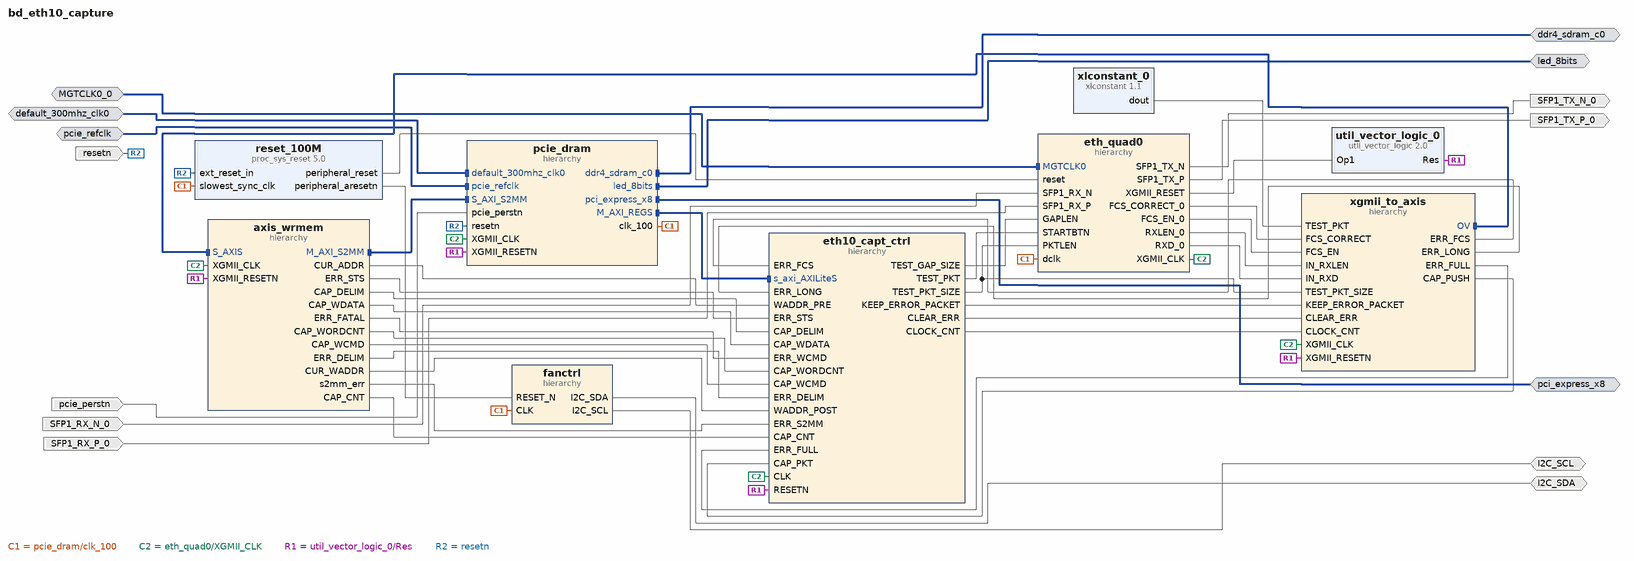
[diagram p0: block diagram of the top level]
# Vivado block design bd_eth10_capture, xcku115-flvb2104-2-e, Vivado 2018.2
create_bd_design bd_eth10_capture

create_bd_intf_port -mode Slave -vlnv xilinx.com:interface:diff_clock_rtl:1.0 MGTCLK0_0
set_property -dict {CONFIG.FREQ_HZ 156250000} [get_bd_intf_ports MGTCLK0_0]
create_bd_intf_port -mode Master -vlnv xilinx.com:interface:ddr4_rtl:1.0 ddr4_sdram_c0
create_bd_intf_port -mode Slave -vlnv xilinx.com:interface:diff_clock_rtl:1.0 default_300mhz_clk0
set_property -dict {CONFIG.FREQ_HZ 300000000} [get_bd_intf_ports default_300mhz_clk0]
create_bd_intf_port -mode Master -vlnv xilinx.com:interface:gpio_rtl:1.0 led_8bits
create_bd_intf_port -mode Master -vlnv xilinx.com:interface:pcie_7x_mgt_rtl:1.0 pci_express_x8
create_bd_intf_port -mode Slave -vlnv xilinx.com:interface:diff_clock_rtl:1.0 pcie_refclk
set_property -dict {CONFIG.FREQ_HZ 100000000} [get_bd_intf_ports pcie_refclk]
create_bd_port -dir IO I2C_SDA
create_bd_port -dir IO I2C_SCL
create_bd_port -dir I SFP1_RX_N_0
create_bd_port -dir I SFP1_RX_P_0
create_bd_port -dir O SFP1_TX_N_0
create_bd_port -dir O SFP1_TX_P_0
create_bd_port -dir I -type rst pcie_perstn
set_property -dict {CONFIG.POLARITY ACTIVE_LOW} [get_bd_ports pcie_perstn]
create_bd_port -dir I -type rst resetn
set_property -dict {CONFIG.POLARITY ACTIVE_LOW} [get_bd_ports resetn]

create_bd_cell -type hier eth_quad0
create_bd_cell -type hier fanctrl
create_bd_cell -type hier pcie_dram
create_bd_cell -type ip -vlnv xilinx.com:ip:proc_sys_reset:5.0 reset_100M
set_property -dict {CONFIG.USE_BOARD_FLOW true CONFIG.RESET_BOARD_INTERFACE resetn} [get_bd_cells reset_100M]
create_bd_cell -type ip -vlnv xilinx.com:ip:util_vector_logic:2.0 util_vector_logic_0
set_property -dict {CONFIG.C_SIZE 1 CONFIG.C_OPERATION not} [get_bd_cells util_vector_logic_0]
create_bd_cell -type hier eth10_capt_ctrl
create_bd_cell -type ip -vlnv xilinx.com:ip:xlconstant:1.1 xlconstant_0
set_property -dict {CONFIG.CONST_VAL 0} [get_bd_cells xlconstant_0]
create_bd_cell -type hier axis_wrmem
create_bd_cell -type hier xgmii_to_axis

# ---- hierarchy /eth_quad0 ----
current_bd_instance /eth_quad0
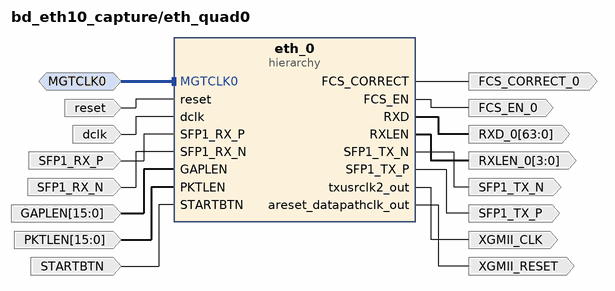
[diagram p1: block diagram inside /eth_quad0]
create_bd_intf_pin -mode Slave -vlnv xilinx.com:interface:diff_clock_rtl:1.0 MGTCLK0
create_bd_pin -dir I -type rst reset
create_bd_pin -dir I -type clk dclk
create_bd_pin -dir I SFP1_RX_P
create_bd_pin -dir O SFP1_TX_N
create_bd_pin -dir O SFP1_TX_P
create_bd_pin -dir I SFP1_RX_N
create_bd_pin -dir O -from 63 -to 0 RXD_0
create_bd_pin -dir O -from 3 -to 0 RXLEN_0
create_bd_pin -dir O FCS_CORRECT_0
create_bd_pin -dir O -type rst XGMII_RESET
create_bd_pin -dir O -type clk XGMII_CLK
create_bd_pin -dir O FCS_EN_0
create_bd_pin -dir I -from 15 -to 0 GAPLEN
create_bd_pin -dir I -from 15 -to 0 PKTLEN
create_bd_pin -dir I STARTBTN

create_bd_cell -type hier eth_0

# ---- hierarchy /eth_quad0/eth_0 ----
current_bd_instance /eth_quad0/eth_0
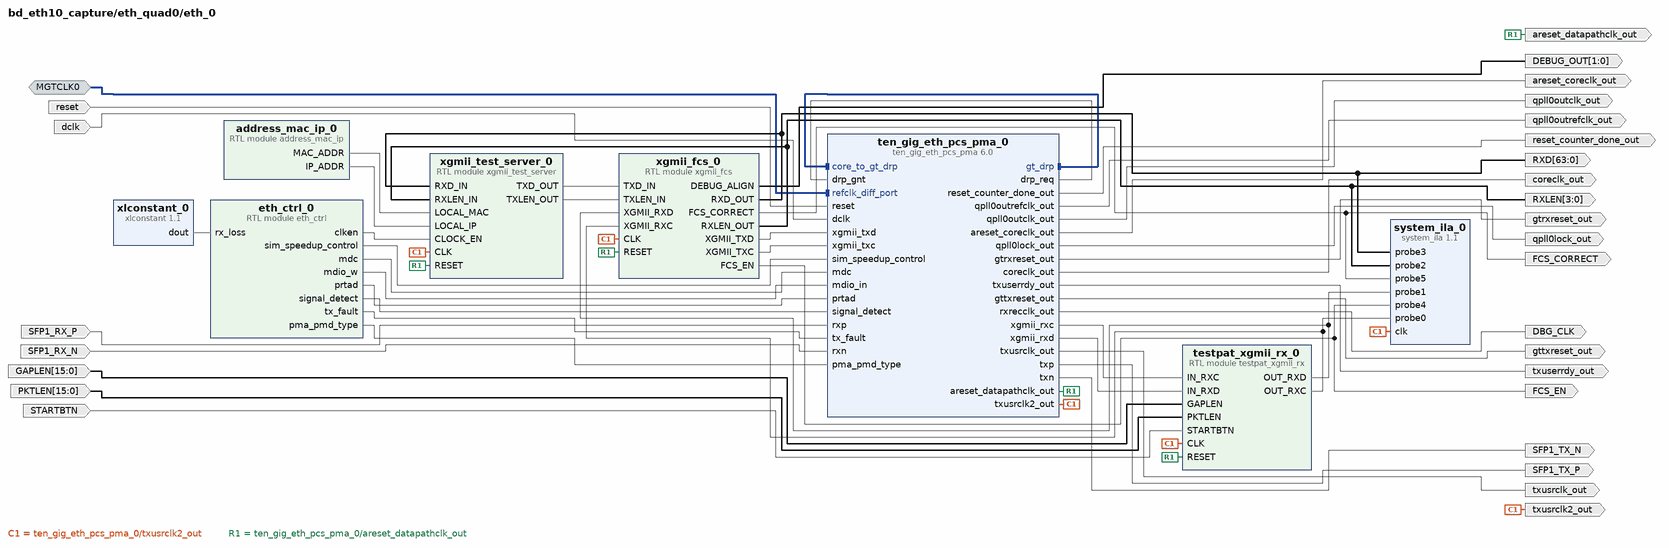
[diagram p2: block diagram inside /eth_quad0/eth_0]
create_bd_intf_pin -mode Slave -vlnv xilinx.com:interface:diff_clock_rtl:1.0 MGTCLK0
create_bd_pin -dir O -from 1 -to 0 DEBUG_OUT
create_bd_pin -dir I -type rst reset
create_bd_pin -dir I -type clk dclk
create_bd_pin -dir O reset_counter_done_out
create_bd_pin -dir O -type clk qpll0outrefclk_out
create_bd_pin -dir O -type clk qpll0outclk_out
create_bd_pin -dir O qpll0lock_out
create_bd_pin -dir O txuserrdy_out
create_bd_pin -dir O -type rst gtrxreset_out
create_bd_pin -dir O -type rst gttxreset_out
create_bd_pin -dir O -type rst areset_coreclk_out
create_bd_pin -dir O -type clk txusrclk_out
create_bd_pin -dir O -type clk coreclk_out
create_bd_pin -dir O -type clk txusrclk2_out
create_bd_pin -dir O SFP1_TX_P
create_bd_pin -dir O SFP1_TX_N
create_bd_pin -dir O -type clk DBG_CLK
create_bd_pin -dir I SFP1_RX_P
create_bd_pin -dir I SFP1_RX_N
create_bd_pin -dir O -type rst areset_datapathclk_out
create_bd_pin -dir O -from 63 -to 0 RXD
create_bd_pin -dir O -from 3 -to 0 RXLEN
create_bd_pin -dir O FCS_CORRECT
create_bd_pin -dir O FCS_EN
create_bd_pin -dir I -from 15 -to 0 GAPLEN
create_bd_pin -dir I -from 15 -to 0 PKTLEN
create_bd_pin -dir I STARTBTN

create_bd_cell -type ip -vlnv xilinx.com:ip:ten_gig_eth_pcs_pma:6.0 ten_gig_eth_pcs_pma_0
set_property -dict [list \
  CONFIG.base_kr BASE-R \
  CONFIG.no_ebuff false \
  CONFIG.SupportLevel 1 \
  CONFIG.Locations X0Y12 \
  CONFIG.RefClk clk0 \
] [get_bd_cells ten_gig_eth_pcs_pma_0]
create_bd_cell -type ip -vlnv xilinx.com:ip:xlconstant:1.1 xlconstant_0
set_property -dict {CONFIG.CONST_VAL 0} [get_bd_cells xlconstant_0]
create_bd_cell -type ip -vlnv xilinx.com:ip:system_ila:1.1 system_ila_0
set_property -dict {CONFIG.C_NUM_OF_PROBES 6 CONFIG.C_MON_TYPE NATIVE} [get_bd_cells system_ila_0]
create_bd_cell -type module -reference xgmii_test_server xgmii_test_server_0
create_bd_cell -type module -reference address_mac_ip address_mac_ip_0
create_bd_cell -type module -reference eth_ctrl eth_ctrl_0
create_bd_cell -type module -reference xgmii_fcs xgmii_fcs_0
create_bd_cell -type module -reference testpat_xgmii_rx testpat_xgmii_rx_0

# ---- hierarchy /fanctrl ----
current_bd_instance /fanctrl
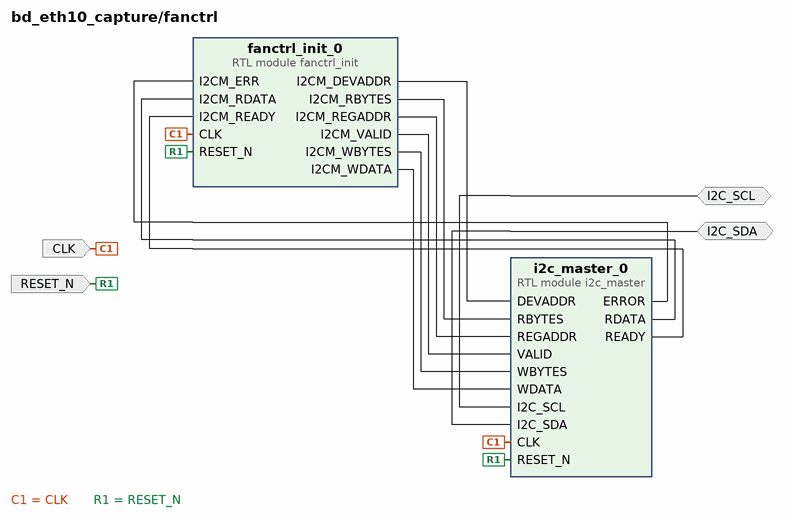
[diagram p3: block diagram inside /fanctrl]
create_bd_pin -dir I -type clk CLK
create_bd_pin -dir IO I2C_SCL
create_bd_pin -dir IO I2C_SDA
create_bd_pin -dir I -type rst RESET_N

create_bd_cell -type module -reference fanctrl_init fanctrl_init_0
create_bd_cell -type module -reference i2c_master i2c_master_0
set_property -dict {CONFIG.CLOCK_DIV 250} [get_bd_cells i2c_master_0]

# ---- hierarchy /pcie_dram ----
current_bd_instance /pcie_dram
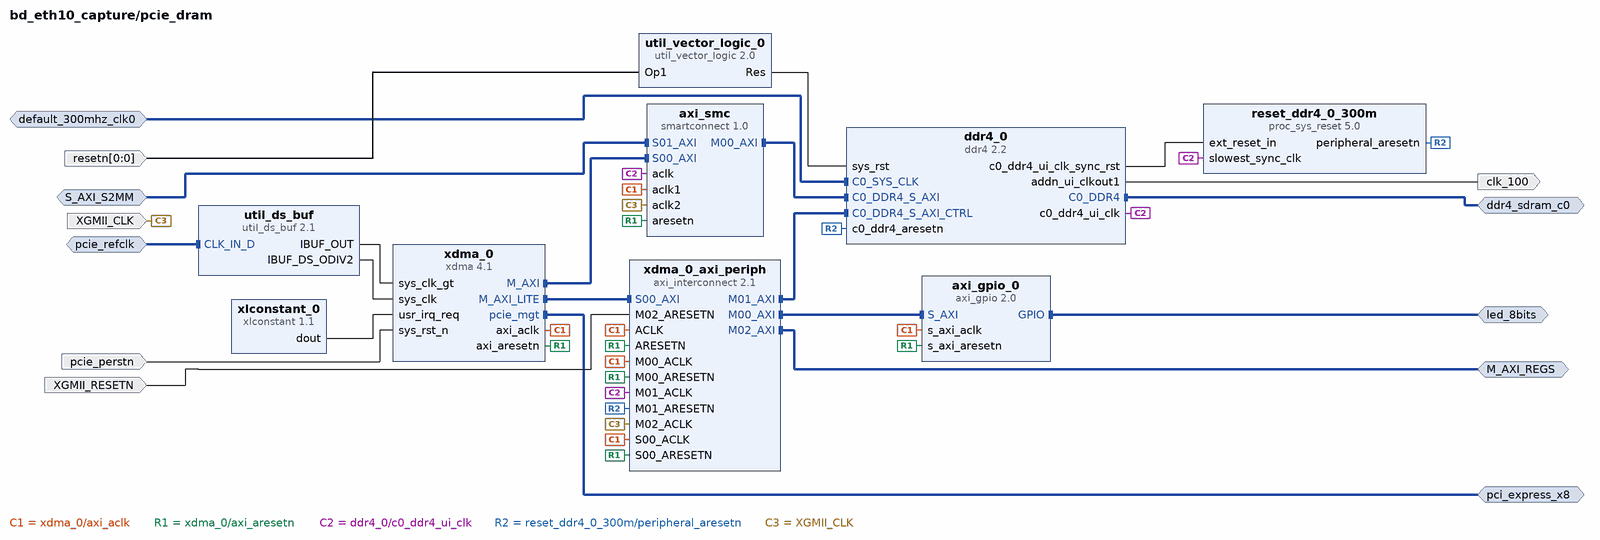
[diagram p4: block diagram inside /pcie_dram]
create_bd_intf_pin -mode Master -vlnv xilinx.com:interface:pcie_7x_mgt_rtl:1.0 pci_express_x8
create_bd_intf_pin -mode Slave -vlnv xilinx.com:interface:diff_clock_rtl:1.0 pcie_refclk
create_bd_intf_pin -mode Master -vlnv xilinx.com:interface:gpio_rtl:1.0 led_8bits
create_bd_intf_pin -mode Slave -vlnv xilinx.com:interface:diff_clock_rtl:1.0 default_300mhz_clk0
create_bd_intf_pin -mode Master -vlnv xilinx.com:interface:ddr4_rtl:1.0 ddr4_sdram_c0
create_bd_intf_pin -mode Slave -vlnv xilinx.com:interface:aximm_rtl:1.0 S_AXI_S2MM
create_bd_intf_pin -mode Master -vlnv xilinx.com:interface:aximm_rtl:1.0 M_AXI_REGS
create_bd_pin -dir I -type rst pcie_perstn
create_bd_pin -dir O -type clk clk_100
create_bd_pin -dir I -type clk XGMII_CLK
create_bd_pin -dir I -from 0 -to 0 resetn
create_bd_pin -dir I -type rst XGMII_RESETN

create_bd_cell -type ip -vlnv xilinx.com:ip:xdma:4.1 xdma_0
set_property -dict [list \
  CONFIG.mode_selection Advanced \
  CONFIG.pl_link_cap_max_link_speed 8.0_GT/s \
  CONFIG.axi_data_width 256_bit \
  CONFIG.axisten_freq 250 \
  CONFIG.en_ext_ch_gt_drp FALSE \
  CONFIG.dedicate_perst true \
  CONFIG.mcap_enablement None \
  CONFIG.pf0_device_id 8038 \
  CONFIG.pf0_revision_id a5 \
  CONFIG.axilite_master_en true \
  CONFIG.axilite_master_size 512 \
  CONFIG.axilite_master_scale Kilobytes \
  CONFIG.xdma_rnum_chnl 1 \
  CONFIG.xdma_wnum_chnl 1 \
  CONFIG.SYS_RST_N_BOARD_INTERFACE pcie_perstn \
  CONFIG.PCIE_BOARD_INTERFACE pci_express_x8 \
  CONFIG.plltype QPLL1 \
  CONFIG.xdma_axi_intf_mm AXI_Memory_Mapped \
  CONFIG.xdma_pcie_64bit_en true \
  CONFIG.xdma_sts_ports false \
  CONFIG.cfg_mgmt_if false \
  CONFIG.xdma_pcie_prefetchable true \
  CONFIG.pf1_bar0_size 128 \
  CONFIG.pf1_bar0_scale Kilobytes \
  CONFIG.pf1_bar1_enabled false \
  CONFIG.dma_reset_source_sel Phy_Ready \
  CONFIG.pcie_id_if false \
  CONFIG.PF0_DEVICE_ID_mqdma 9038 \
  CONFIG.PF2_DEVICE_ID_mqdma 9038 \
  CONFIG.PF3_DEVICE_ID_mqdma 9038 \
] [get_bd_cells xdma_0]
create_bd_cell -type ip -vlnv xilinx.com:ip:util_ds_buf:2.1 util_ds_buf
set_property -dict {CONFIG.USE_BOARD_FLOW true CONFIG.DIFF_CLK_IN_BOARD_INTERFACE pcie_refclk} [get_bd_cells util_ds_buf]
create_bd_cell -type ip -vlnv xilinx.com:ip:xlconstant:1.1 xlconstant_0
set_property -dict {CONFIG.CONST_VAL 0} [get_bd_cells xlconstant_0]
create_bd_cell -type ip -vlnv xilinx.com:ip:axi_gpio:2.0 axi_gpio_0
set_property -dict {CONFIG.USE_BOARD_FLOW true CONFIG.GPIO_BOARD_INTERFACE led_8bits} [get_bd_cells axi_gpio_0]
create_bd_cell -type ip -vlnv xilinx.com:ip:ddr4:2.2 ddr4_0
set_property -dict [list \
  CONFIG.C0_CLOCK_BOARD_INTERFACE default_300mhz_clk0 \
  CONFIG.C0_DDR4_BOARD_INTERFACE ddr4_sdram_c0 \
] [get_bd_cells ddr4_0]
create_bd_cell -type ip -vlnv xilinx.com:ip:util_vector_logic:2.0 util_vector_logic_0
set_property -dict {CONFIG.C_SIZE 1 CONFIG.C_OPERATION not} [get_bd_cells util_vector_logic_0]
create_bd_cell -type ip -vlnv xilinx.com:ip:proc_sys_reset:5.0 reset_ddr4_0_300m
create_bd_cell -type ip -vlnv xilinx.com:ip:axi_interconnect:2.1 xdma_0_axi_periph
set_property -dict {CONFIG.NUM_MI 3} [get_bd_cells xdma_0_axi_periph]
create_bd_cell -type ip -vlnv xilinx.com:ip:smartconnect:1.0 axi_smc
set_property -dict {CONFIG.NUM_SI 2 CONFIG.NUM_CLKS 3} [get_bd_cells axi_smc]

# ---- hierarchy /eth10_capt_ctrl ----
current_bd_instance /eth10_capt_ctrl
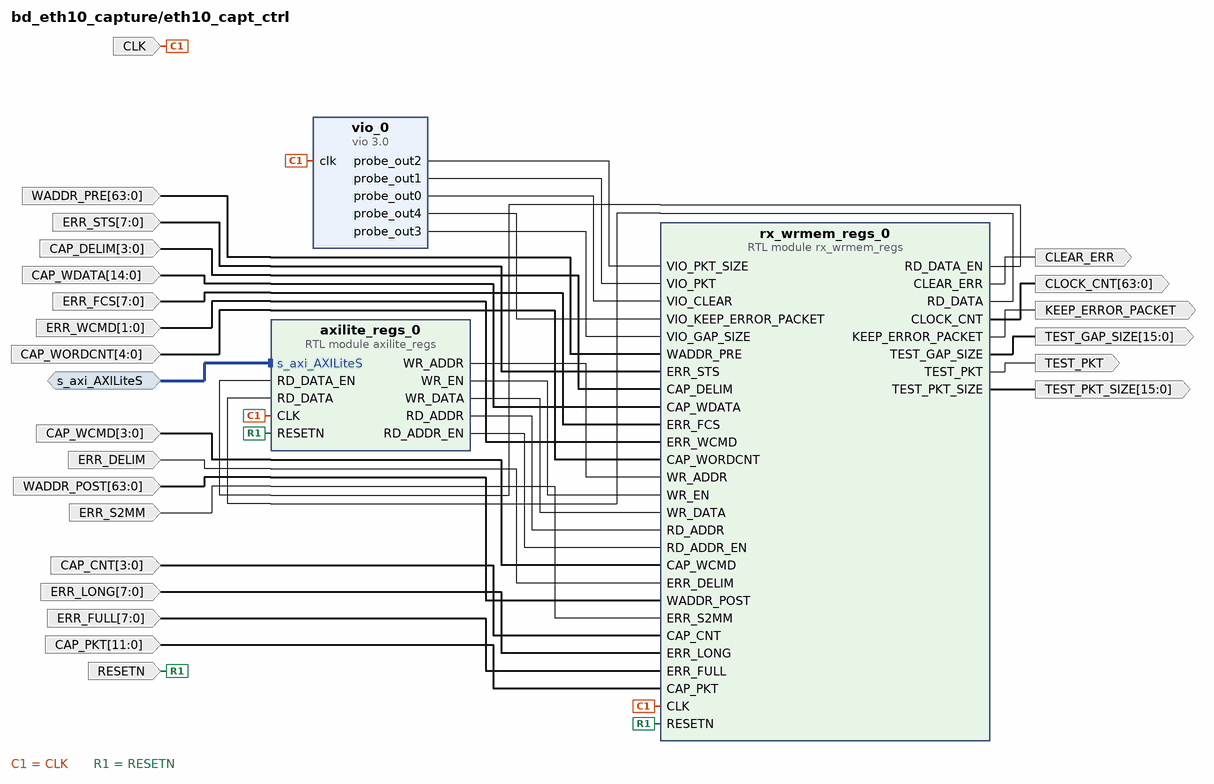
[diagram p5: block diagram inside /eth10_capt_ctrl]
create_bd_intf_pin -mode Slave -vlnv xilinx.com:interface:aximm_rtl:1.0 s_axi_AXILiteS
create_bd_pin -dir I -type clk CLK
create_bd_pin -dir I -type rst RESETN
create_bd_pin -dir I -from 63 -to 0 WADDR_PRE
create_bd_pin -dir I -from 7 -to 0 ERR_STS
create_bd_pin -dir O KEEP_ERROR_PACKET
create_bd_pin -dir I -from 3 -to 0 CAP_DELIM
create_bd_pin -dir I -from 14 -to 0 CAP_WDATA
create_bd_pin -dir I -from 7 -to 0 ERR_FCS
create_bd_pin -dir I -from 1 -to 0 ERR_WCMD
create_bd_pin -dir I -from 4 -to 0 CAP_WORDCNT
create_bd_pin -dir I -from 3 -to 0 CAP_WCMD
create_bd_pin -dir I ERR_DELIM
create_bd_pin -dir O -from 15 -to 0 TEST_GAP_SIZE
create_bd_pin -dir O -from 15 -to 0 TEST_PKT_SIZE
create_bd_pin -dir O TEST_PKT
create_bd_pin -dir I -from 63 -to 0 WADDR_POST
create_bd_pin -dir O CLEAR_ERR
create_bd_pin -dir I ERR_S2MM
create_bd_pin -dir I -from 3 -to 0 CAP_CNT
create_bd_pin -dir I -from 7 -to 0 ERR_LONG
create_bd_pin -dir I -from 7 -to 0 ERR_FULL
create_bd_pin -dir I -from 11 -to 0 CAP_PKT
create_bd_pin -dir O -from 63 -to 0 CLOCK_CNT

create_bd_cell -type ip -vlnv xilinx.com:ip:vio:3.0 vio_0
set_property -dict [list \
  CONFIG.C_PROBE_OUT3_INIT_VAL 0x000c \
  CONFIG.C_PROBE_OUT2_INIT_VAL 0x0040 \
  CONFIG.C_PROBE_OUT1_INIT_VAL 0x0 \
  CONFIG.C_PROBE_OUT3_WIDTH 16 \
  CONFIG.C_PROBE_OUT2_WIDTH 16 \
  CONFIG.C_PROBE_OUT1_WIDTH 1 \
  CONFIG.C_NUM_PROBE_OUT 5 \
  CONFIG.C_NUM_PROBE_IN 0 \
] [get_bd_cells vio_0]
create_bd_cell -type module -reference axilite_regs axilite_regs_0
create_bd_cell -type module -reference rx_wrmem_regs rx_wrmem_regs_0

# ---- hierarchy /axis_wrmem ----
current_bd_instance /axis_wrmem
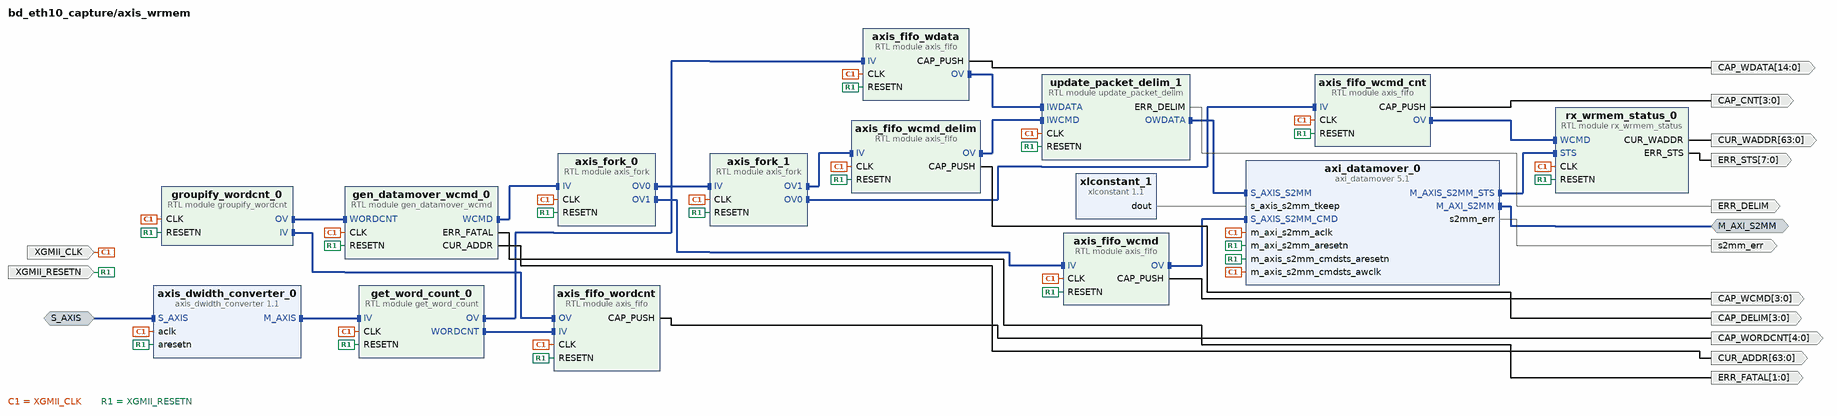
[diagram p6: block diagram inside /axis_wrmem]
create_bd_intf_pin -mode Master -vlnv xilinx.com:interface:aximm_rtl:1.0 M_AXI_S2MM
create_bd_intf_pin -mode Slave -vlnv xilinx.com:interface:axis_rtl:1.0 S_AXIS
create_bd_pin -dir O ERR_DELIM
create_bd_pin -dir O s2mm_err
create_bd_pin -dir O -from 1 -to 0 ERR_FATAL
create_bd_pin -dir I -type clk XGMII_CLK
create_bd_pin -dir I -type rst XGMII_RESETN
create_bd_pin -dir O -from 3 -to 0 CAP_WCMD
create_bd_pin -dir O -from 4 -to 0 CAP_WORDCNT
create_bd_pin -dir O -from 14 -to 0 CAP_WDATA
create_bd_pin -dir O -from 3 -to 0 CAP_DELIM
create_bd_pin -dir O -from 3 -to 0 CAP_CNT
create_bd_pin -dir O -from 63 -to 0 CUR_ADDR
create_bd_pin -dir O -from 7 -to 0 ERR_STS
create_bd_pin -dir O -from 63 -to 0 CUR_WADDR

create_bd_cell -type ip -vlnv xilinx.com:ip:axi_datamover:5.1 axi_datamover_0
set_property -dict [list \
  CONFIG.c_m_axi_s2mm_data_width 128 \
  CONFIG.c_s_axis_s2mm_tdata_width 128 \
  CONFIG.c_s2mm_burst_size 256 \
  CONFIG.c_s2mm_btt_used 23 \
  CONFIG.c_enable_mm2s 0 \
  CONFIG.c_addr_width 64 \
  CONFIG.c_dummy 1 \
] [get_bd_cells axi_datamover_0]
create_bd_cell -type ip -vlnv xilinx.com:ip:xlconstant:1.1 xlconstant_1
set_property -dict {CONFIG.CONST_WIDTH 16 CONFIG.CONST_VAL 65535} [get_bd_cells xlconstant_1]
create_bd_cell -type ip -vlnv xilinx.com:ip:axis_dwidth_converter:1.1 axis_dwidth_converter_0
set_property -dict [list \
  CONFIG.S_TDATA_NUM_BYTES 8 \
  CONFIG.M_TDATA_NUM_BYTES 16 \
  CONFIG.TID_WIDTH 0 \
  CONFIG.TDEST_WIDTH 0 \
  CONFIG.TUSER_BITS_PER_BYTE 0 \
  CONFIG.HAS_TLAST 1 \
  CONFIG.HAS_TSTRB 0 \
  CONFIG.HAS_TKEEP 0 \
  CONFIG.HAS_MI_TKEEP 1 \
] [get_bd_cells axis_dwidth_converter_0]
create_bd_cell -type module -reference update_packet_delim update_packet_delim_1
create_bd_cell -type module -reference groupify_wordcnt groupify_wordcnt_0
create_bd_cell -type module -reference get_word_count get_word_count_0
set_property -dict {CONFIG.WORD_SIZE_L2 4} [get_bd_cells get_word_count_0]
create_bd_cell -type module -reference gen_datamover_wcmd gen_datamover_wcmd_0
create_bd_cell -type module -reference rx_wrmem_status rx_wrmem_status_0
create_bd_cell -type module -reference axis_fifo axis_fifo_wcmd
set_property -dict {CONFIG.WIDTH_DATA 104 CONFIG.FIFO_SIZE_L2 0 CONFIG.FIFO_REG 8} [get_bd_cells axis_fifo_wcmd]
create_bd_cell -type module -reference axis_fifo axis_fifo_wcmd_cnt
set_property -dict {CONFIG.WIDTH_DATA 104 CONFIG.FIFO_SIZE_L2 0 CONFIG.FIFO_REG 8} [get_bd_cells axis_fifo_wcmd_cnt]
create_bd_cell -type module -reference axis_fifo axis_fifo_wcmd_delim
set_property -dict {CONFIG.WIDTH_DATA 104 CONFIG.FIFO_SIZE_L2 0 CONFIG.FIFO_REG 8} [get_bd_cells axis_fifo_wcmd_delim]
create_bd_cell -type module -reference axis_fifo axis_fifo_wdata
set_property -dict {CONFIG.WIDTH_DATA 128 CONFIG.FIFO_SIZE_L2 14} [get_bd_cells axis_fifo_wdata]
create_bd_cell -type module -reference axis_fifo axis_fifo_wordcnt
set_property -dict [list \
  CONFIG.WIDTH_DATA 16 \
  CONFIG.WIDTH_LAST 0 \
  CONFIG.FIFO_SIZE_L2 0 \
  CONFIG.FIFO_REG 16 \
] [get_bd_cells axis_fifo_wordcnt]
create_bd_cell -type module -reference axis_fork axis_fork_0
set_property -dict {CONFIG.WIDTH_DATA 104 CONFIG.WIDTH_LAST 0} [get_bd_cells axis_fork_0]
create_bd_cell -type module -reference axis_fork axis_fork_1
set_property -dict {CONFIG.WIDTH_DATA 104 CONFIG.WIDTH_LAST 0} [get_bd_cells axis_fork_1]

# ---- hierarchy /xgmii_to_axis ----
current_bd_instance /xgmii_to_axis
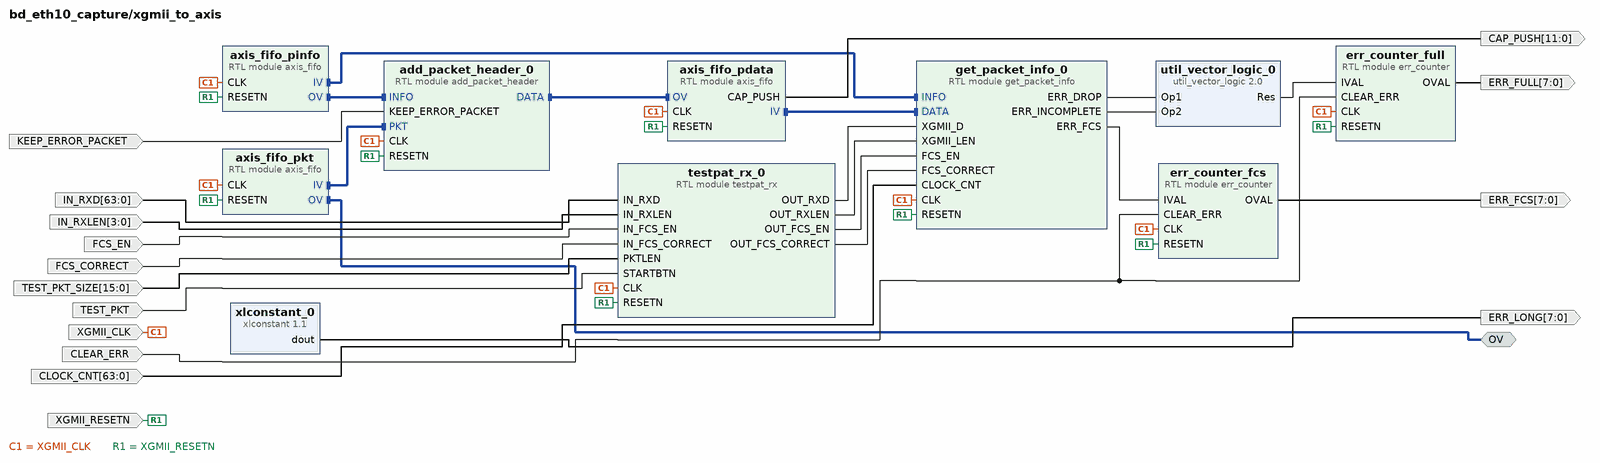
[diagram p7: block diagram inside /xgmii_to_axis]
create_bd_intf_pin -mode Master -vlnv xilinx.com:interface:axis_rtl:1.0 OV
create_bd_pin -dir I -type clk XGMII_CLK
create_bd_pin -dir I -from 63 -to 0 IN_RXD
create_bd_pin -dir I -from 3 -to 0 IN_RXLEN
create_bd_pin -dir I -type rst XGMII_RESETN
create_bd_pin -dir I FCS_EN
create_bd_pin -dir I FCS_CORRECT
create_bd_pin -dir O -from 7 -to 0 ERR_FCS
create_bd_pin -dir I -from 15 -to 0 TEST_PKT_SIZE
create_bd_pin -dir I TEST_PKT
create_bd_pin -dir I CLEAR_ERR
create_bd_pin -dir O -from 7 -to 0 ERR_LONG
create_bd_pin -dir O -from 7 -to 0 ERR_FULL
create_bd_pin -dir O -from 11 -to 0 CAP_PUSH
create_bd_pin -dir I KEEP_ERROR_PACKET
create_bd_pin -dir I -from 63 -to 0 CLOCK_CNT

create_bd_cell -type ip -vlnv xilinx.com:ip:xlconstant:1.1 xlconstant_0
set_property -dict {CONFIG.CONST_WIDTH 8 CONFIG.CONST_VAL 0} [get_bd_cells xlconstant_0]
create_bd_cell -type ip -vlnv xilinx.com:ip:util_vector_logic:2.0 util_vector_logic_0
set_property -dict {CONFIG.C_SIZE 1 CONFIG.C_OPERATION or} [get_bd_cells util_vector_logic_0]
create_bd_cell -type module -reference axis_fifo axis_fifo_pdata
set_property -dict {CONFIG.WIDTH_LAST 0 CONFIG.FIFO_SIZE_L2 11} [get_bd_cells axis_fifo_pdata]
create_bd_cell -type module -reference axis_fifo axis_fifo_pinfo
set_property -dict {CONFIG.WIDTH_DATA 64 CONFIG.WIDTH_LAST 0 CONFIG.FIFO_SIZE_L2 10} [get_bd_cells axis_fifo_pinfo]
create_bd_cell -type module -reference axis_fifo axis_fifo_pkt
set_property -dict {CONFIG.FIFO_SIZE_L2 0} [get_bd_cells axis_fifo_pkt]
create_bd_cell -type module -reference err_counter err_counter_fcs
create_bd_cell -type module -reference err_counter err_counter_full
create_bd_cell -type module -reference testpat_rx testpat_rx_0
create_bd_cell -type module -reference add_packet_header add_packet_header_0
create_bd_cell -type module -reference get_packet_info get_packet_info_0

# ---- connections ----

current_bd_instance /eth_quad0
connect_bd_intf_net [get_bd_intf_pins MGTCLK0] [get_bd_intf_pins eth_0/MGTCLK0]
connect_bd_net [get_bd_pins reset] [get_bd_pins eth_0/reset]
connect_bd_net [get_bd_pins dclk] [get_bd_pins eth_0/dclk]
connect_bd_net [get_bd_pins SFP1_RX_P] [get_bd_pins eth_0/SFP1_RX_P]
connect_bd_net [get_bd_pins eth_0/SFP1_TX_N] [get_bd_pins SFP1_TX_N]
connect_bd_net [get_bd_pins eth_0/SFP1_TX_P] [get_bd_pins SFP1_TX_P]
connect_bd_net [get_bd_pins SFP1_RX_N] [get_bd_pins eth_0/SFP1_RX_N]
connect_bd_net [get_bd_pins eth_0/RXD] [get_bd_pins RXD_0]
connect_bd_net [get_bd_pins eth_0/RXLEN] [get_bd_pins RXLEN_0]
connect_bd_net [get_bd_pins eth_0/FCS_CORRECT] [get_bd_pins FCS_CORRECT_0]
connect_bd_net [get_bd_pins eth_0/areset_datapathclk_out] [get_bd_pins XGMII_RESET]
connect_bd_net [get_bd_pins eth_0/txusrclk2_out] [get_bd_pins XGMII_CLK]
connect_bd_net [get_bd_pins eth_0/FCS_EN] [get_bd_pins FCS_EN_0]
connect_bd_net -net GAPLEN_0_1 [get_bd_pins GAPLEN] [get_bd_pins eth_0/GAPLEN]
connect_bd_net -net PKTLEN_0_1 [get_bd_pins PKTLEN] [get_bd_pins eth_0/PKTLEN]
connect_bd_net -net STARTBTN_0_1 [get_bd_pins STARTBTN] [get_bd_pins eth_0/STARTBTN]

current_bd_instance /eth_quad0/eth_0
connect_bd_intf_net [get_bd_intf_pins ten_gig_eth_pcs_pma_0/core_to_gt_drp] [get_bd_intf_pins ten_gig_eth_pcs_pma_0/gt_drp]
connect_bd_intf_net [get_bd_intf_pins MGTCLK0] [get_bd_intf_pins ten_gig_eth_pcs_pma_0/refclk_diff_port]
connect_bd_net -net CLK_1 [get_bd_pins ten_gig_eth_pcs_pma_0/txusrclk2_out] \
  [get_bd_pins txusrclk2_out] [get_bd_pins system_ila_0/clk] [get_bd_pins xgmii_test_server_0/CLK] \
  [get_bd_pins xgmii_fcs_0/CLK] [get_bd_pins testpat_xgmii_rx_0/CLK]
connect_bd_net [get_bd_pins xgmii_fcs_0/RXD_OUT] [get_bd_pins RXD] [get_bd_pins system_ila_0/probe3] [get_bd_pins xgmii_test_server_0/RXD_IN]
connect_bd_net [get_bd_pins xgmii_fcs_0/RXLEN_OUT] [get_bd_pins RXLEN] [get_bd_pins system_ila_0/probe2] [get_bd_pins xgmii_test_server_0/RXLEN_IN]
connect_bd_net [get_bd_pins xgmii_test_server_0/TXD_OUT] [get_bd_pins xgmii_fcs_0/TXD_IN]
connect_bd_net [get_bd_pins xgmii_test_server_0/TXLEN_OUT] [get_bd_pins xgmii_fcs_0/TXLEN_IN]
connect_bd_net [get_bd_pins xgmii_fcs_0/DEBUG_ALIGN] [get_bd_pins DEBUG_OUT]
connect_bd_net [get_bd_pins address_mac_ip_0/MAC_ADDR] [get_bd_pins xgmii_test_server_0/LOCAL_MAC]
connect_bd_net [get_bd_pins address_mac_ip_0/IP_ADDR] [get_bd_pins xgmii_test_server_0/LOCAL_IP]
connect_bd_net [get_bd_pins ten_gig_eth_pcs_pma_0/drp_req] [get_bd_pins ten_gig_eth_pcs_pma_0/drp_gnt]
connect_bd_net [get_bd_pins xgmii_fcs_0/XGMII_TXD] [get_bd_pins ten_gig_eth_pcs_pma_0/xgmii_txd]
connect_bd_net [get_bd_pins xgmii_fcs_0/XGMII_TXC] [get_bd_pins ten_gig_eth_pcs_pma_0/xgmii_txc]
connect_bd_net -net ten_gig_eth_pcs_pma_0_xgmii_rxd [get_bd_pins testpat_xgmii_rx_0/OUT_RXD] \
  [get_bd_pins system_ila_0/probe1] [get_bd_pins xgmii_fcs_0/XGMII_RXD]
connect_bd_net -net ten_gig_eth_pcs_pma_0_xgmii_rxc [get_bd_pins testpat_xgmii_rx_0/OUT_RXC] \
  [get_bd_pins system_ila_0/probe0] [get_bd_pins xgmii_fcs_0/XGMII_RXC]
connect_bd_net [get_bd_pins reset] [get_bd_pins ten_gig_eth_pcs_pma_0/reset]
connect_bd_net [get_bd_pins dclk] [get_bd_pins ten_gig_eth_pcs_pma_0/dclk]
connect_bd_net [get_bd_pins ten_gig_eth_pcs_pma_0/reset_counter_done_out] [get_bd_pins reset_counter_done_out]
connect_bd_net [get_bd_pins ten_gig_eth_pcs_pma_0/qpll0outrefclk_out] [get_bd_pins qpll0outrefclk_out]
connect_bd_net [get_bd_pins ten_gig_eth_pcs_pma_0/qpll0outclk_out] [get_bd_pins qpll0outclk_out]
connect_bd_net [get_bd_pins ten_gig_eth_pcs_pma_0/qpll0lock_out] [get_bd_pins qpll0lock_out]
connect_bd_net [get_bd_pins ten_gig_eth_pcs_pma_0/txuserrdy_out] [get_bd_pins txuserrdy_out]
connect_bd_net [get_bd_pins ten_gig_eth_pcs_pma_0/gtrxreset_out] [get_bd_pins gtrxreset_out]
connect_bd_net [get_bd_pins ten_gig_eth_pcs_pma_0/gttxreset_out] [get_bd_pins gttxreset_out]
connect_bd_net [get_bd_pins ten_gig_eth_pcs_pma_0/areset_coreclk_out] [get_bd_pins areset_coreclk_out]
connect_bd_net [get_bd_pins ten_gig_eth_pcs_pma_0/txusrclk_out] [get_bd_pins txusrclk_out]
connect_bd_net [get_bd_pins ten_gig_eth_pcs_pma_0/coreclk_out] [get_bd_pins coreclk_out]
connect_bd_net [get_bd_pins ten_gig_eth_pcs_pma_0/txp] [get_bd_pins SFP1_TX_P]
connect_bd_net [get_bd_pins ten_gig_eth_pcs_pma_0/txn] [get_bd_pins SFP1_TX_N]
connect_bd_net [get_bd_pins ten_gig_eth_pcs_pma_0/rxrecclk_out] [get_bd_pins DBG_CLK]
connect_bd_net [get_bd_pins SFP1_RX_P] [get_bd_pins ten_gig_eth_pcs_pma_0/rxp]
connect_bd_net [get_bd_pins SFP1_RX_N] [get_bd_pins ten_gig_eth_pcs_pma_0/rxn]
connect_bd_net [get_bd_pins eth_ctrl_0/clken] [get_bd_pins xgmii_test_server_0/CLOCK_EN]
connect_bd_net [get_bd_pins eth_ctrl_0/sim_speedup_control] [get_bd_pins ten_gig_eth_pcs_pma_0/sim_speedup_control]
connect_bd_net [get_bd_pins eth_ctrl_0/mdc] [get_bd_pins ten_gig_eth_pcs_pma_0/mdc]
connect_bd_net [get_bd_pins eth_ctrl_0/mdio_w] [get_bd_pins ten_gig_eth_pcs_pma_0/mdio_in]
connect_bd_net [get_bd_pins eth_ctrl_0/prtad] [get_bd_pins ten_gig_eth_pcs_pma_0/prtad]
connect_bd_net [get_bd_pins eth_ctrl_0/signal_detect] [get_bd_pins ten_gig_eth_pcs_pma_0/signal_detect]
connect_bd_net [get_bd_pins eth_ctrl_0/tx_fault] [get_bd_pins ten_gig_eth_pcs_pma_0/tx_fault]
connect_bd_net [get_bd_pins eth_ctrl_0/pma_pmd_type] [get_bd_pins ten_gig_eth_pcs_pma_0/pma_pmd_type]
connect_bd_net [get_bd_pins xlconstant_0/dout] [get_bd_pins eth_ctrl_0/rx_loss]
connect_bd_net [get_bd_pins ten_gig_eth_pcs_pma_0/areset_datapathclk_out] \
  [get_bd_pins areset_datapathclk_out] [get_bd_pins xgmii_test_server_0/RESET] [get_bd_pins xgmii_fcs_0/RESET] \
  [get_bd_pins testpat_xgmii_rx_0/RESET]
connect_bd_net [get_bd_pins xgmii_fcs_0/FCS_CORRECT] [get_bd_pins FCS_CORRECT] [get_bd_pins system_ila_0/probe5]
connect_bd_net [get_bd_pins xgmii_fcs_0/FCS_EN] [get_bd_pins FCS_EN] [get_bd_pins system_ila_0/probe4]
connect_bd_net [get_bd_pins ten_gig_eth_pcs_pma_0/xgmii_rxc] [get_bd_pins testpat_xgmii_rx_0/IN_RXC]
connect_bd_net [get_bd_pins ten_gig_eth_pcs_pma_0/xgmii_rxd] [get_bd_pins testpat_xgmii_rx_0/IN_RXD]
connect_bd_net -net GAPLEN_0_1 [get_bd_pins GAPLEN] [get_bd_pins testpat_xgmii_rx_0/GAPLEN]
connect_bd_net -net PKTLEN_0_1 [get_bd_pins PKTLEN] [get_bd_pins testpat_xgmii_rx_0/PKTLEN]
connect_bd_net -net STARTBTN_0_1 [get_bd_pins STARTBTN] [get_bd_pins testpat_xgmii_rx_0/STARTBTN]

current_bd_instance /fanctrl
connect_bd_net [get_bd_pins CLK] [get_bd_pins fanctrl_init_0/CLK] [get_bd_pins i2c_master_0/CLK]
connect_bd_net [get_bd_pins I2C_SDA] [get_bd_pins i2c_master_0/I2C_SDA]
connect_bd_net [get_bd_pins I2C_SCL] [get_bd_pins i2c_master_0/I2C_SCL]
connect_bd_net [get_bd_pins RESET_N] [get_bd_pins fanctrl_init_0/RESET_N] [get_bd_pins i2c_master_0/RESET_N]
connect_bd_net [get_bd_pins fanctrl_init_0/I2CM_DEVADDR] [get_bd_pins i2c_master_0/DEVADDR]
connect_bd_net [get_bd_pins fanctrl_init_0/I2CM_RBYTES] [get_bd_pins i2c_master_0/RBYTES]
connect_bd_net [get_bd_pins fanctrl_init_0/I2CM_REGADDR] [get_bd_pins i2c_master_0/REGADDR]
connect_bd_net [get_bd_pins fanctrl_init_0/I2CM_VALID] [get_bd_pins i2c_master_0/VALID]
connect_bd_net [get_bd_pins fanctrl_init_0/I2CM_WBYTES] [get_bd_pins i2c_master_0/WBYTES]
connect_bd_net [get_bd_pins fanctrl_init_0/I2CM_WDATA] [get_bd_pins i2c_master_0/WDATA]
connect_bd_net [get_bd_pins i2c_master_0/ERROR] [get_bd_pins fanctrl_init_0/I2CM_ERR]
connect_bd_net [get_bd_pins i2c_master_0/RDATA] [get_bd_pins fanctrl_init_0/I2CM_RDATA]
connect_bd_net [get_bd_pins i2c_master_0/READY] [get_bd_pins fanctrl_init_0/I2CM_READY]

current_bd_instance /pcie_dram
connect_bd_intf_net [get_bd_intf_pins xdma_0/M_AXI_LITE] [get_bd_intf_pins xdma_0_axi_periph/S00_AXI]
connect_bd_intf_net [get_bd_intf_pins xdma_0_axi_periph/M00_AXI] [get_bd_intf_pins axi_gpio_0/S_AXI]
connect_bd_intf_net [get_bd_intf_pins xdma_0_axi_periph/M01_AXI] [get_bd_intf_pins ddr4_0/C0_DDR4_S_AXI_CTRL]
connect_bd_intf_net [get_bd_intf_pins xdma_0/M_AXI] [get_bd_intf_pins axi_smc/S00_AXI]
connect_bd_intf_net [get_bd_intf_pins axi_smc/M00_AXI] [get_bd_intf_pins ddr4_0/C0_DDR4_S_AXI]
connect_bd_intf_net [get_bd_intf_pins pci_express_x8] [get_bd_intf_pins xdma_0/pcie_mgt]
connect_bd_intf_net [get_bd_intf_pins pcie_refclk] [get_bd_intf_pins util_ds_buf/CLK_IN_D]
connect_bd_intf_net [get_bd_intf_pins led_8bits] [get_bd_intf_pins axi_gpio_0/GPIO]
connect_bd_intf_net [get_bd_intf_pins default_300mhz_clk0] [get_bd_intf_pins ddr4_0/C0_SYS_CLK]
connect_bd_intf_net [get_bd_intf_pins ddr4_sdram_c0] [get_bd_intf_pins ddr4_0/C0_DDR4]
connect_bd_intf_net [get_bd_intf_pins S_AXI_S2MM] [get_bd_intf_pins axi_smc/S01_AXI]
connect_bd_intf_net [get_bd_intf_pins M_AXI_REGS] [get_bd_intf_pins xdma_0_axi_periph/M02_AXI]
connect_bd_net [get_bd_pins pcie_perstn] [get_bd_pins xdma_0/sys_rst_n]
connect_bd_net [get_bd_pins util_ds_buf/IBUF_OUT] [get_bd_pins xdma_0/sys_clk_gt]
connect_bd_net [get_bd_pins util_ds_buf/IBUF_DS_ODIV2] [get_bd_pins xdma_0/sys_clk]
connect_bd_net [get_bd_pins xlconstant_0/dout] [get_bd_pins xdma_0/usr_irq_req]
connect_bd_net [get_bd_pins xdma_0/axi_aclk] \
  [get_bd_pins axi_gpio_0/s_axi_aclk] [get_bd_pins axi_smc/aclk1] [get_bd_pins xdma_0_axi_periph/ACLK] \
  [get_bd_pins xdma_0_axi_periph/S00_ACLK] [get_bd_pins xdma_0_axi_periph/M00_ACLK]
connect_bd_net [get_bd_pins xdma_0/axi_aresetn] \
  [get_bd_pins axi_gpio_0/s_axi_aresetn] [get_bd_pins axi_smc/aresetn] [get_bd_pins xdma_0_axi_periph/S00_ARESETN] \
  [get_bd_pins xdma_0_axi_periph/M00_ARESETN] [get_bd_pins xdma_0_axi_periph/ARESETN]
connect_bd_net [get_bd_pins util_vector_logic_0/Res] [get_bd_pins ddr4_0/sys_rst]
connect_bd_net [get_bd_pins ddr4_0/c0_ddr4_ui_clk] \
  [get_bd_pins reset_ddr4_0_300m/slowest_sync_clk] [get_bd_pins axi_smc/aclk] [get_bd_pins xdma_0_axi_periph/M01_ACLK]
connect_bd_net [get_bd_pins ddr4_0/c0_ddr4_ui_clk_sync_rst] [get_bd_pins reset_ddr4_0_300m/ext_reset_in]
connect_bd_net [get_bd_pins ddr4_0/addn_ui_clkout1] [get_bd_pins clk_100]
connect_bd_net [get_bd_pins reset_ddr4_0_300m/peripheral_aresetn] [get_bd_pins ddr4_0/c0_ddr4_aresetn] [get_bd_pins xdma_0_axi_periph/M01_ARESETN]
connect_bd_net -net aclk2_1 [get_bd_pins XGMII_CLK] [get_bd_pins axi_smc/aclk2] [get_bd_pins xdma_0_axi_periph/M02_ACLK]
connect_bd_net [get_bd_pins resetn] [get_bd_pins util_vector_logic_0/Op1]
connect_bd_net -net M02_ARESETN_1 [get_bd_pins XGMII_RESETN] [get_bd_pins xdma_0_axi_periph/M02_ARESETN]

current_bd_instance /eth10_capt_ctrl
connect_bd_intf_net [get_bd_intf_pins s_axi_AXILiteS] [get_bd_intf_pins axilite_regs_0/s_axi_AXILiteS]
connect_bd_net [get_bd_pins CLK] [get_bd_pins vio_0/clk] [get_bd_pins axilite_regs_0/CLK] [get_bd_pins rx_wrmem_regs_0/CLK]
connect_bd_net [get_bd_pins RESETN] [get_bd_pins axilite_regs_0/RESETN] [get_bd_pins rx_wrmem_regs_0/RESETN]
connect_bd_net [get_bd_pins WADDR_PRE] [get_bd_pins rx_wrmem_regs_0/WADDR_PRE]
connect_bd_net [get_bd_pins ERR_STS] [get_bd_pins rx_wrmem_regs_0/ERR_STS]
connect_bd_net [get_bd_pins rx_wrmem_regs_0/KEEP_ERROR_PACKET] [get_bd_pins KEEP_ERROR_PACKET]
connect_bd_net [get_bd_pins CAP_DELIM] [get_bd_pins rx_wrmem_regs_0/CAP_DELIM]
connect_bd_net [get_bd_pins CAP_WDATA] [get_bd_pins rx_wrmem_regs_0/CAP_WDATA]
connect_bd_net [get_bd_pins vio_0/probe_out2] [get_bd_pins rx_wrmem_regs_0/VIO_PKT_SIZE]
connect_bd_net [get_bd_pins vio_0/probe_out1] [get_bd_pins rx_wrmem_regs_0/VIO_PKT]
connect_bd_net [get_bd_pins vio_0/probe_out0] [get_bd_pins rx_wrmem_regs_0/VIO_CLEAR]
connect_bd_net [get_bd_pins vio_0/probe_out4] [get_bd_pins rx_wrmem_regs_0/VIO_KEEP_ERROR_PACKET]
connect_bd_net [get_bd_pins vio_0/probe_out3] [get_bd_pins rx_wrmem_regs_0/VIO_GAP_SIZE]
connect_bd_net [get_bd_pins ERR_FCS] [get_bd_pins rx_wrmem_regs_0/ERR_FCS]
connect_bd_net [get_bd_pins ERR_WCMD] [get_bd_pins rx_wrmem_regs_0/ERR_WCMD]
connect_bd_net [get_bd_pins CAP_WORDCNT] [get_bd_pins rx_wrmem_regs_0/CAP_WORDCNT]
connect_bd_net [get_bd_pins CAP_WCMD] [get_bd_pins rx_wrmem_regs_0/CAP_WCMD]
connect_bd_net [get_bd_pins ERR_DELIM] [get_bd_pins rx_wrmem_regs_0/ERR_DELIM]
connect_bd_net [get_bd_pins rx_wrmem_regs_0/TEST_GAP_SIZE] [get_bd_pins TEST_GAP_SIZE]
connect_bd_net [get_bd_pins rx_wrmem_regs_0/TEST_PKT_SIZE] [get_bd_pins TEST_PKT_SIZE]
connect_bd_net [get_bd_pins rx_wrmem_regs_0/TEST_PKT] [get_bd_pins TEST_PKT]
connect_bd_net [get_bd_pins WADDR_POST] [get_bd_pins rx_wrmem_regs_0/WADDR_POST]
connect_bd_net [get_bd_pins rx_wrmem_regs_0/CLEAR_ERR] [get_bd_pins CLEAR_ERR]
connect_bd_net [get_bd_pins ERR_S2MM] [get_bd_pins rx_wrmem_regs_0/ERR_S2MM]
connect_bd_net [get_bd_pins CAP_CNT] [get_bd_pins rx_wrmem_regs_0/CAP_CNT]
connect_bd_net [get_bd_pins axilite_regs_0/WR_ADDR] [get_bd_pins rx_wrmem_regs_0/WR_ADDR]
connect_bd_net [get_bd_pins axilite_regs_0/WR_EN] [get_bd_pins rx_wrmem_regs_0/WR_EN]
connect_bd_net [get_bd_pins axilite_regs_0/WR_DATA] [get_bd_pins rx_wrmem_regs_0/WR_DATA]
connect_bd_net [get_bd_pins rx_wrmem_regs_0/RD_DATA_EN] [get_bd_pins axilite_regs_0/RD_DATA_EN]
connect_bd_net [get_bd_pins rx_wrmem_regs_0/RD_DATA] [get_bd_pins axilite_regs_0/RD_DATA]
connect_bd_net [get_bd_pins axilite_regs_0/RD_ADDR] [get_bd_pins rx_wrmem_regs_0/RD_ADDR]
connect_bd_net [get_bd_pins axilite_regs_0/RD_ADDR_EN] [get_bd_pins rx_wrmem_regs_0/RD_ADDR_EN]
connect_bd_net [get_bd_pins ERR_LONG] [get_bd_pins rx_wrmem_regs_0/ERR_LONG]
connect_bd_net [get_bd_pins ERR_FULL] [get_bd_pins rx_wrmem_regs_0/ERR_FULL]
connect_bd_net [get_bd_pins CAP_PKT] [get_bd_pins rx_wrmem_regs_0/CAP_PKT]
connect_bd_net [get_bd_pins rx_wrmem_regs_0/CLOCK_CNT] [get_bd_pins CLOCK_CNT]

current_bd_instance /axis_wrmem
connect_bd_intf_net [get_bd_intf_pins groupify_wordcnt_0/OV] [get_bd_intf_pins gen_datamover_wcmd_0/WORDCNT]
connect_bd_intf_net [get_bd_intf_pins get_word_count_0/OV] [get_bd_intf_pins axis_fifo_wdata/IV]
connect_bd_intf_net [get_bd_intf_pins axis_fifo_wcmd_delim/OV] [get_bd_intf_pins update_packet_delim_1/IWCMD]
connect_bd_intf_net [get_bd_intf_pins groupify_wordcnt_0/IV] [get_bd_intf_pins axis_fifo_wordcnt/OV]
connect_bd_intf_net [get_bd_intf_pins get_word_count_0/WORDCNT] [get_bd_intf_pins axis_fifo_wordcnt/IV]
connect_bd_intf_net [get_bd_intf_pins axis_fork_0/OV0] [get_bd_intf_pins axis_fork_1/IV]
connect_bd_intf_net [get_bd_intf_pins gen_datamover_wcmd_0/WCMD] [get_bd_intf_pins axis_fork_0/IV]
connect_bd_intf_net [get_bd_intf_pins axis_fork_1/OV0] [get_bd_intf_pins axis_fifo_wcmd_cnt/IV]
connect_bd_intf_net [get_bd_intf_pins axis_fork_1/OV1] [get_bd_intf_pins axis_fifo_wcmd_delim/IV]
connect_bd_intf_net [get_bd_intf_pins axis_fork_0/OV1] [get_bd_intf_pins axis_fifo_wcmd/IV]
connect_bd_intf_net [get_bd_intf_pins axis_fifo_wcmd_cnt/OV] [get_bd_intf_pins rx_wrmem_status_0/WCMD]
connect_bd_intf_net [get_bd_intf_pins axis_fifo_wdata/OV] [get_bd_intf_pins update_packet_delim_1/IWDATA]
connect_bd_intf_net [get_bd_intf_pins update_packet_delim_1/OWDATA] [get_bd_intf_pins axi_datamover_0/S_AXIS_S2MM]
connect_bd_intf_net [get_bd_intf_pins axi_datamover_0/S_AXIS_S2MM_CMD] [get_bd_intf_pins axis_fifo_wcmd/OV]
connect_bd_intf_net [get_bd_intf_pins rx_wrmem_status_0/STS] [get_bd_intf_pins axi_datamover_0/M_AXIS_S2MM_STS]
connect_bd_intf_net [get_bd_intf_pins get_word_count_0/IV] [get_bd_intf_pins axis_dwidth_converter_0/M_AXIS]
connect_bd_intf_net [get_bd_intf_pins M_AXI_S2MM] [get_bd_intf_pins axi_datamover_0/M_AXI_S2MM]
connect_bd_intf_net [get_bd_intf_pins S_AXIS] [get_bd_intf_pins axis_dwidth_converter_0/S_AXIS]
connect_bd_net [get_bd_pins xlconstant_1/dout] [get_bd_pins axi_datamover_0/s_axis_s2mm_tkeep]
connect_bd_net [get_bd_pins update_packet_delim_1/ERR_DELIM] [get_bd_pins ERR_DELIM]
connect_bd_net [get_bd_pins axi_datamover_0/s2mm_err] [get_bd_pins s2mm_err]
connect_bd_net [get_bd_pins gen_datamover_wcmd_0/ERR_FATAL] [get_bd_pins ERR_FATAL]
connect_bd_net [get_bd_pins XGMII_CLK] \
  [get_bd_pins axi_datamover_0/m_axis_s2mm_cmdsts_awclk] [get_bd_pins axi_datamover_0/m_axi_s2mm_aclk] \
  [get_bd_pins axis_dwidth_converter_0/aclk] [get_bd_pins update_packet_delim_1/CLK] [get_bd_pins groupify_wordcnt_0/CLK] \
  [get_bd_pins get_word_count_0/CLK] [get_bd_pins gen_datamover_wcmd_0/CLK] [get_bd_pins rx_wrmem_status_0/CLK] \
  [get_bd_pins axis_fifo_wcmd/CLK] [get_bd_pins axis_fifo_wcmd_cnt/CLK] [get_bd_pins axis_fifo_wcmd_delim/CLK] \
  [get_bd_pins axis_fifo_wdata/CLK] [get_bd_pins axis_fifo_wordcnt/CLK] [get_bd_pins axis_fork_0/CLK] \
  [get_bd_pins axis_fork_1/CLK]
connect_bd_net [get_bd_pins XGMII_RESETN] \
  [get_bd_pins axi_datamover_0/m_axis_s2mm_cmdsts_aresetn] [get_bd_pins axi_datamover_0/m_axi_s2mm_aresetn] \
  [get_bd_pins axis_dwidth_converter_0/aresetn] [get_bd_pins update_packet_delim_1/RESETN] \
  [get_bd_pins groupify_wordcnt_0/RESETN] [get_bd_pins get_word_count_0/RESETN] [get_bd_pins gen_datamover_wcmd_0/RESETN] \
  [get_bd_pins rx_wrmem_status_0/RESETN] [get_bd_pins axis_fifo_wcmd/RESETN] [get_bd_pins axis_fifo_wcmd_cnt/RESETN] \
  [get_bd_pins axis_fifo_wcmd_delim/RESETN] [get_bd_pins axis_fifo_wdata/RESETN] [get_bd_pins axis_fifo_wordcnt/RESETN] \
  [get_bd_pins axis_fork_0/RESETN] [get_bd_pins axis_fork_1/RESETN]
connect_bd_net [get_bd_pins axis_fifo_wcmd/CAP_PUSH] [get_bd_pins CAP_WCMD]
connect_bd_net [get_bd_pins axis_fifo_wordcnt/CAP_PUSH] [get_bd_pins CAP_WORDCNT]
connect_bd_net [get_bd_pins axis_fifo_wdata/CAP_PUSH] [get_bd_pins CAP_WDATA]
connect_bd_net [get_bd_pins axis_fifo_wcmd_delim/CAP_PUSH] [get_bd_pins CAP_DELIM]
connect_bd_net [get_bd_pins axis_fifo_wcmd_cnt/CAP_PUSH] [get_bd_pins CAP_CNT]
connect_bd_net [get_bd_pins gen_datamover_wcmd_0/CUR_ADDR] [get_bd_pins CUR_ADDR]
connect_bd_net [get_bd_pins rx_wrmem_status_0/ERR_STS] [get_bd_pins ERR_STS]
connect_bd_net [get_bd_pins rx_wrmem_status_0/CUR_WADDR] [get_bd_pins CUR_WADDR]

current_bd_instance /xgmii_to_axis
connect_bd_intf_net -intf_net axis_fifo_0_OV [get_bd_intf_pins add_packet_header_0/DATA] [get_bd_intf_pins axis_fifo_pdata/OV]
connect_bd_intf_net [get_bd_intf_pins axis_fifo_pinfo/OV] [get_bd_intf_pins add_packet_header_0/INFO]
connect_bd_intf_net [get_bd_intf_pins axis_fifo_pkt/IV] [get_bd_intf_pins add_packet_header_0/PKT]
connect_bd_intf_net [get_bd_intf_pins axis_fifo_pdata/IV] [get_bd_intf_pins get_packet_info_0/DATA]
connect_bd_intf_net [get_bd_intf_pins axis_fifo_pinfo/IV] [get_bd_intf_pins get_packet_info_0/INFO]
connect_bd_intf_net -intf_net axis_fifo_0_OV1 [get_bd_intf_pins OV] [get_bd_intf_pins axis_fifo_pkt/OV]
connect_bd_net [get_bd_pins testpat_rx_0/OUT_RXD] [get_bd_pins get_packet_info_0/XGMII_D]
connect_bd_net [get_bd_pins testpat_rx_0/OUT_RXLEN] [get_bd_pins get_packet_info_0/XGMII_LEN]
connect_bd_net [get_bd_pins testpat_rx_0/OUT_FCS_EN] [get_bd_pins get_packet_info_0/FCS_EN]
connect_bd_net [get_bd_pins testpat_rx_0/OUT_FCS_CORRECT] [get_bd_pins get_packet_info_0/FCS_CORRECT]
connect_bd_net [get_bd_pins XGMII_CLK] \
  [get_bd_pins axis_fifo_pdata/CLK] [get_bd_pins axis_fifo_pinfo/CLK] [get_bd_pins axis_fifo_pkt/CLK] \
  [get_bd_pins err_counter_fcs/CLK] [get_bd_pins err_counter_full/CLK] [get_bd_pins testpat_rx_0/CLK] \
  [get_bd_pins add_packet_header_0/CLK] [get_bd_pins get_packet_info_0/CLK]
connect_bd_net [get_bd_pins IN_RXD] [get_bd_pins testpat_rx_0/IN_RXD]
connect_bd_net [get_bd_pins IN_RXLEN] [get_bd_pins testpat_rx_0/IN_RXLEN]
connect_bd_net [get_bd_pins XGMII_RESETN] \
  [get_bd_pins axis_fifo_pdata/RESETN] [get_bd_pins axis_fifo_pinfo/RESETN] [get_bd_pins axis_fifo_pkt/RESETN] \
  [get_bd_pins err_counter_fcs/RESETN] [get_bd_pins err_counter_full/RESETN] [get_bd_pins testpat_rx_0/RESETN] \
  [get_bd_pins add_packet_header_0/RESETN] [get_bd_pins get_packet_info_0/RESETN]
connect_bd_net [get_bd_pins FCS_EN] [get_bd_pins testpat_rx_0/IN_FCS_EN]
connect_bd_net [get_bd_pins FCS_CORRECT] [get_bd_pins testpat_rx_0/IN_FCS_CORRECT]
connect_bd_net -net PKTLEN_1 [get_bd_pins TEST_PKT_SIZE] [get_bd_pins testpat_rx_0/PKTLEN]
connect_bd_net -net STARTBTN_1 [get_bd_pins TEST_PKT] [get_bd_pins testpat_rx_0/STARTBTN]
connect_bd_net [get_bd_pins axis_fifo_pdata/CAP_PUSH] [get_bd_pins CAP_PUSH]
connect_bd_net [get_bd_pins xlconstant_0/dout] [get_bd_pins ERR_LONG]
connect_bd_net [get_bd_pins CLEAR_ERR] [get_bd_pins err_counter_fcs/CLEAR_ERR] [get_bd_pins err_counter_full/CLEAR_ERR]
connect_bd_net [get_bd_pins err_counter_fcs/OVAL] [get_bd_pins ERR_FCS]
connect_bd_net [get_bd_pins err_counter_full/OVAL] [get_bd_pins ERR_FULL]
connect_bd_net [get_bd_pins get_packet_info_0/ERR_DROP] [get_bd_pins util_vector_logic_0/Op1]
connect_bd_net [get_bd_pins get_packet_info_0/ERR_INCOMPLETE] [get_bd_pins util_vector_logic_0/Op2]
connect_bd_net [get_bd_pins get_packet_info_0/ERR_FCS] [get_bd_pins err_counter_fcs/IVAL]
connect_bd_net [get_bd_pins util_vector_logic_0/Res] [get_bd_pins err_counter_full/IVAL]
connect_bd_net -net KEEP_ERROR_PACKET_0_1 [get_bd_pins KEEP_ERROR_PACKET] [get_bd_pins add_packet_header_0/KEEP_ERROR_PACKET]
connect_bd_net -net CLOCK_CNT_0_1 [get_bd_pins CLOCK_CNT] [get_bd_pins get_packet_info_0/CLOCK_CNT]

current_bd_instance /
connect_bd_intf_net [get_bd_intf_pins pcie_dram/S_AXI_S2MM] [get_bd_intf_pins axis_wrmem/M_AXI_S2MM]
connect_bd_intf_net [get_bd_intf_pins axis_wrmem/S_AXIS] [get_bd_intf_pins xgmii_to_axis/OV]
connect_bd_intf_net [get_bd_intf_pins pcie_dram/M_AXI_REGS] [get_bd_intf_pins eth10_capt_ctrl/s_axi_AXILiteS]
connect_bd_intf_net [get_bd_intf_ports MGTCLK0_0] [get_bd_intf_pins eth_quad0/MGTCLK0]
connect_bd_intf_net [get_bd_intf_ports ddr4_sdram_c0] [get_bd_intf_pins pcie_dram/ddr4_sdram_c0]
connect_bd_intf_net -intf_net default_300mhz_clk0_1 [get_bd_intf_ports default_300mhz_clk0] [get_bd_intf_pins pcie_dram/default_300mhz_clk0]
connect_bd_intf_net [get_bd_intf_ports led_8bits] [get_bd_intf_pins pcie_dram/led_8bits]
connect_bd_intf_net [get_bd_intf_ports pci_express_x8] [get_bd_intf_pins pcie_dram/pci_express_x8]
connect_bd_intf_net [get_bd_intf_ports pcie_refclk] [get_bd_intf_pins pcie_dram/pcie_refclk]
connect_bd_net -net CLK_1 [get_bd_pins pcie_dram/clk_100] \
  [get_bd_pins reset_100M/slowest_sync_clk] [get_bd_pins fanctrl/CLK] [get_bd_pins eth_quad0/dclk]
connect_bd_net [get_bd_ports I2C_SDA] [get_bd_pins fanctrl/I2C_SDA]
connect_bd_net [get_bd_ports I2C_SCL] [get_bd_pins fanctrl/I2C_SCL]
connect_bd_net -net RESET_N_1 [get_bd_pins reset_100M/peripheral_aresetn] [get_bd_pins fanctrl/RESET_N]
connect_bd_net -net SFP1_RX_N_0_1 [get_bd_ports SFP1_RX_N_0] [get_bd_pins eth_quad0/SFP1_RX_N]
connect_bd_net -net SFP1_RX_P_0_1 [get_bd_ports SFP1_RX_P_0] [get_bd_pins eth_quad0/SFP1_RX_P]
connect_bd_net [get_bd_pins eth_quad0/XGMII_CLK] \
  [get_bd_pins pcie_dram/XGMII_CLK] [get_bd_pins axis_wrmem/XGMII_CLK] [get_bd_pins xgmii_to_axis/XGMII_CLK] \
  [get_bd_pins eth10_capt_ctrl/CLK]
connect_bd_net -net eth_quad_SFP1_TX_N [get_bd_pins eth_quad0/SFP1_TX_N] [get_bd_ports SFP1_TX_N_0]
connect_bd_net -net eth_quad_SFP1_TX_P [get_bd_pins eth_quad0/SFP1_TX_P] [get_bd_ports SFP1_TX_P_0]
connect_bd_net [get_bd_ports pcie_perstn] [get_bd_pins pcie_dram/pcie_perstn]
connect_bd_net -net reset_1 [get_bd_pins reset_100M/peripheral_reset] [get_bd_pins eth_quad0/reset]
connect_bd_net [get_bd_pins eth_quad0/XGMII_RESET] [get_bd_pins util_vector_logic_0/Op1]
connect_bd_net -net rst_ten_gig_eth_pcs_pma_0_156M_peripheral_aresetn [get_bd_pins util_vector_logic_0/Res] \
  [get_bd_pins pcie_dram/XGMII_RESETN] [get_bd_pins axis_wrmem/XGMII_RESETN] [get_bd_pins xgmii_to_axis/XGMII_RESETN] \
  [get_bd_pins eth10_capt_ctrl/RESETN]
connect_bd_net [get_bd_ports resetn] [get_bd_pins reset_100M/ext_reset_in] [get_bd_pins pcie_dram/resetn]
connect_bd_net [get_bd_pins eth10_capt_ctrl/TEST_PKT_SIZE] [get_bd_pins eth_quad0/PKTLEN] [get_bd_pins xgmii_to_axis/TEST_PKT_SIZE]
connect_bd_net [get_bd_pins xlconstant_0/dout] [get_bd_pins xgmii_to_axis/TEST_PKT]
connect_bd_net [get_bd_pins eth_quad0/FCS_CORRECT_0] [get_bd_pins xgmii_to_axis/FCS_CORRECT]
connect_bd_net [get_bd_pins eth_quad0/FCS_EN_0] [get_bd_pins xgmii_to_axis/FCS_EN]
connect_bd_net [get_bd_pins eth_quad0/RXLEN_0] [get_bd_pins xgmii_to_axis/IN_RXLEN]
connect_bd_net [get_bd_pins eth_quad0/RXD_0] [get_bd_pins xgmii_to_axis/IN_RXD]
connect_bd_net [get_bd_pins axis_wrmem/CUR_ADDR] [get_bd_pins eth10_capt_ctrl/WADDR_PRE]
connect_bd_net [get_bd_pins axis_wrmem/ERR_STS] [get_bd_pins eth10_capt_ctrl/ERR_STS]
connect_bd_net -net KEEP_ERROR_PACKET_1 [get_bd_pins eth10_capt_ctrl/KEEP_ERROR_PACKET] [get_bd_pins xgmii_to_axis/KEEP_ERROR_PACKET]
connect_bd_net [get_bd_pins axis_wrmem/CAP_DELIM] [get_bd_pins eth10_capt_ctrl/CAP_DELIM]
connect_bd_net [get_bd_pins axis_wrmem/CAP_WDATA] [get_bd_pins eth10_capt_ctrl/CAP_WDATA]
connect_bd_net [get_bd_pins xgmii_to_axis/ERR_FCS] [get_bd_pins eth10_capt_ctrl/ERR_FCS]
connect_bd_net [get_bd_pins axis_wrmem/ERR_FATAL] [get_bd_pins eth10_capt_ctrl/ERR_WCMD]
connect_bd_net [get_bd_pins axis_wrmem/CAP_WORDCNT] [get_bd_pins eth10_capt_ctrl/CAP_WORDCNT]
connect_bd_net [get_bd_pins axis_wrmem/CAP_WCMD] [get_bd_pins eth10_capt_ctrl/CAP_WCMD]
connect_bd_net [get_bd_pins axis_wrmem/ERR_DELIM] [get_bd_pins eth10_capt_ctrl/ERR_DELIM]
connect_bd_net -net GAPLEN_1 [get_bd_pins eth10_capt_ctrl/TEST_GAP_SIZE] [get_bd_pins eth_quad0/GAPLEN]
connect_bd_net -net STARTBTN_1 [get_bd_pins eth10_capt_ctrl/TEST_PKT] [get_bd_pins eth_quad0/STARTBTN]
connect_bd_net [get_bd_pins axis_wrmem/CUR_WADDR] [get_bd_pins eth10_capt_ctrl/WADDR_POST]
connect_bd_net -net CLEAR_ERR_1 [get_bd_pins eth10_capt_ctrl/CLEAR_ERR] [get_bd_pins xgmii_to_axis/CLEAR_ERR]
connect_bd_net [get_bd_pins axis_wrmem/s2mm_err] [get_bd_pins eth10_capt_ctrl/ERR_S2MM]
connect_bd_net [get_bd_pins axis_wrmem/CAP_CNT] [get_bd_pins eth10_capt_ctrl/CAP_CNT]
connect_bd_net [get_bd_pins xgmii_to_axis/ERR_LONG] [get_bd_pins eth10_capt_ctrl/ERR_LONG]
connect_bd_net [get_bd_pins xgmii_to_axis/ERR_FULL] [get_bd_pins eth10_capt_ctrl/ERR_FULL]
connect_bd_net [get_bd_pins xgmii_to_axis/CAP_PUSH] [get_bd_pins eth10_capt_ctrl/CAP_PKT]
connect_bd_net -net CLOCK_CNT_1 [get_bd_pins eth10_capt_ctrl/CLOCK_CNT] [get_bd_pins xgmii_to_axis/CLOCK_CNT]

# ---- address map ----
assign_bd_address -offset 0x0000000000000000 -range 4G -target_address_space [get_bd_addr_spaces axis_wrmem/axi_datamover_0/Data_S2MM] [get_bd_addr_segs pcie_dram/ddr4_0/C0_DDR4_MEMORY_MAP/C0_DDR4_ADDRESS_BLOCK]
assign_bd_address -offset 0x0000000000000000 -range 4G -target_address_space [get_bd_addr_spaces pcie_dram/xdma_0/M_AXI] [get_bd_addr_segs pcie_dram/ddr4_0/C0_DDR4_MEMORY_MAP/C0_DDR4_ADDRESS_BLOCK]
assign_bd_address -offset 0x00000000 -range 64K -target_address_space [get_bd_addr_spaces pcie_dram/xdma_0/M_AXI_LITE] [get_bd_addr_segs eth10_capt_ctrl/axilite_regs_0/s_axi_AXILiteS/reg0]
assign_bd_address -offset 0x00100000 -range 1M -target_address_space [get_bd_addr_spaces pcie_dram/xdma_0/M_AXI_LITE] [get_bd_addr_segs pcie_dram/ddr4_0/C0_DDR4_MEMORY_MAP_CTRL/C0_REG]
assign_bd_address -offset 0x00200000 -range 64K -target_address_space [get_bd_addr_spaces pcie_dram/xdma_0/M_AXI_LITE] [get_bd_addr_segs pcie_dram/axi_gpio_0/S_AXI/Reg]

validate_bd_design
save_bd_design
